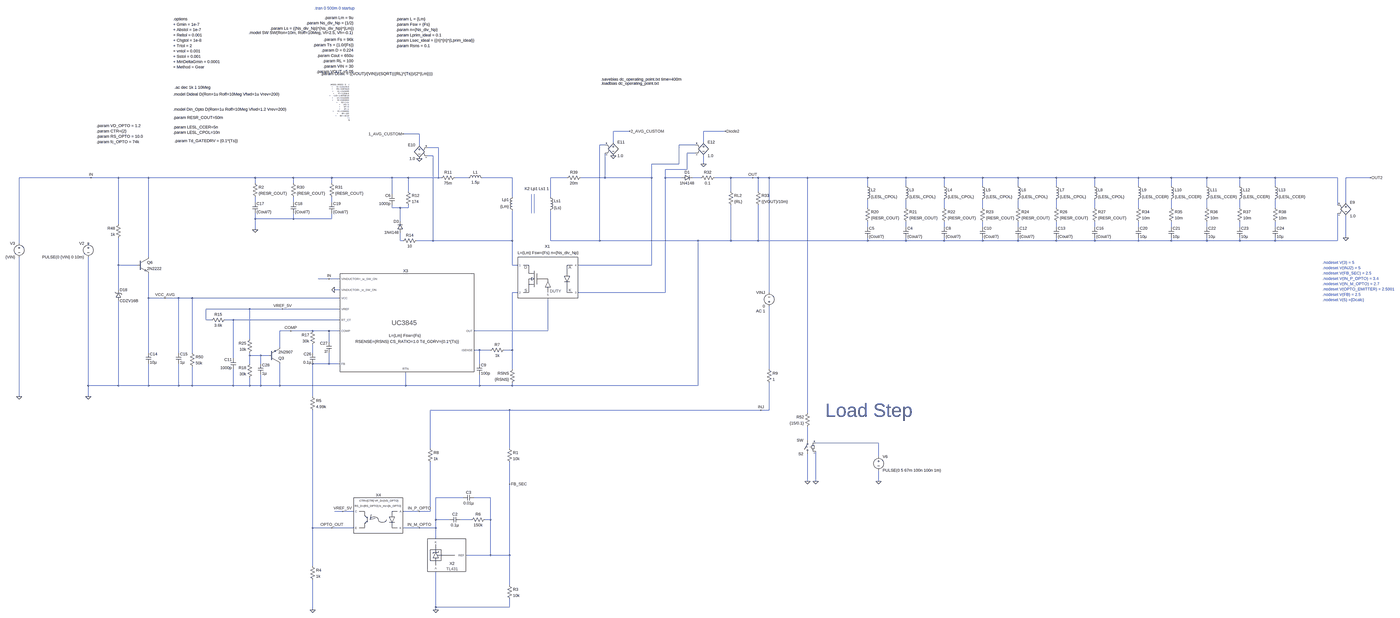
[diagram p0: schematic Demo_Flyback_AVGD_Model.asc, whole sheet]
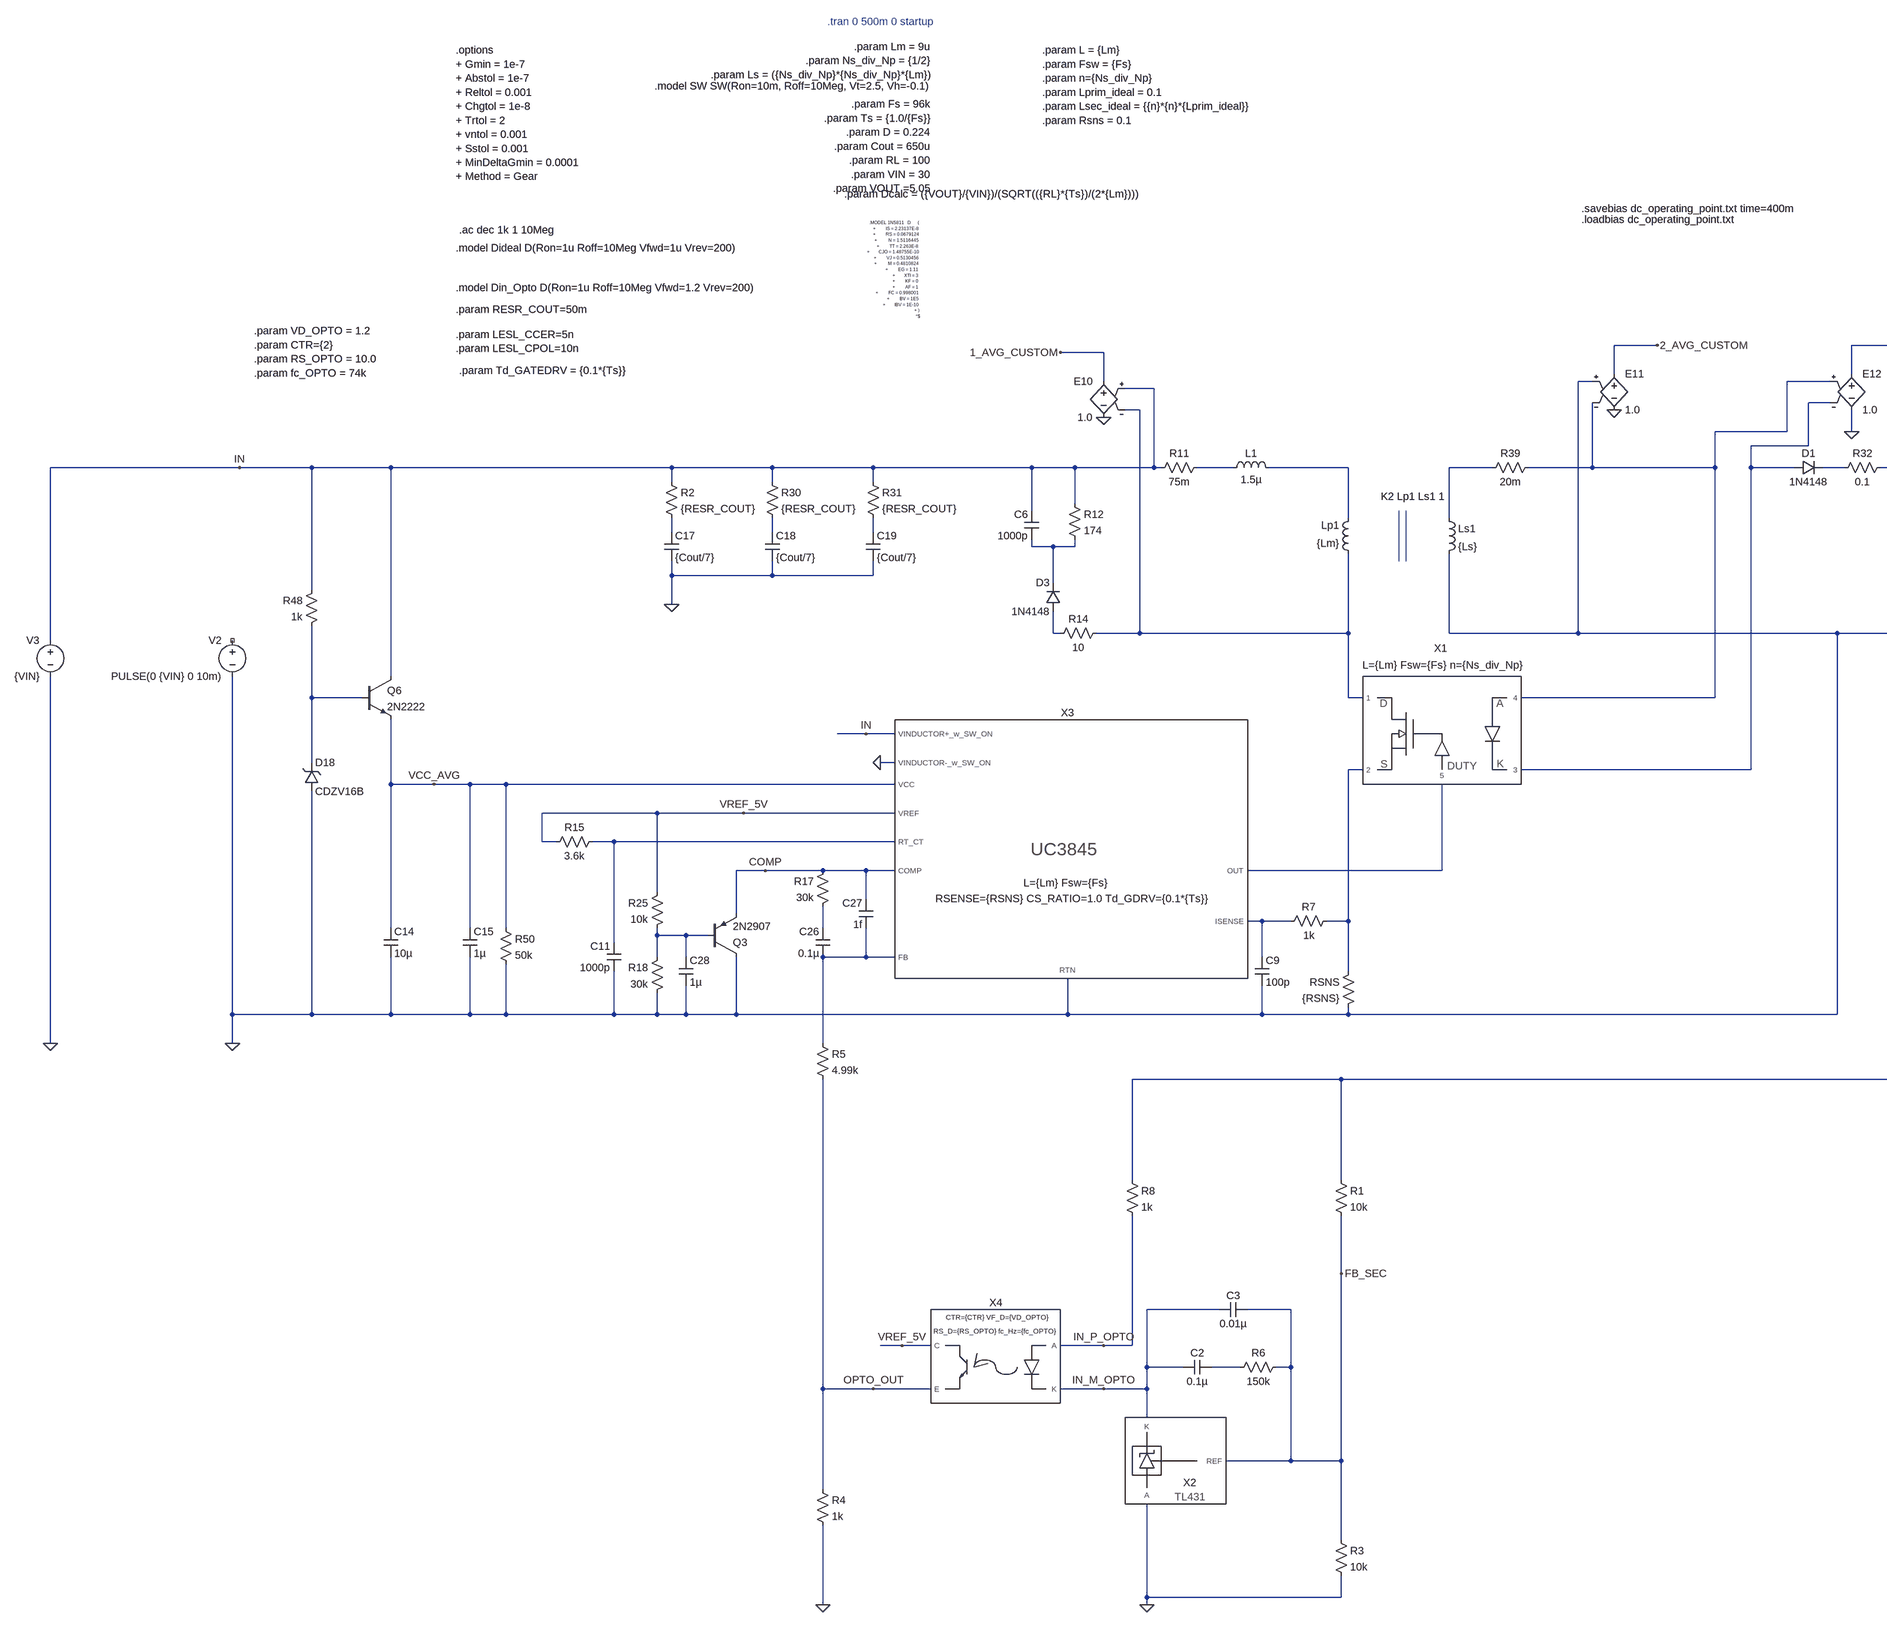
[diagram p1: schematic Demo_Flyback_AVGD_Model.asc, part, row 1 of 1, column 1 of 2]
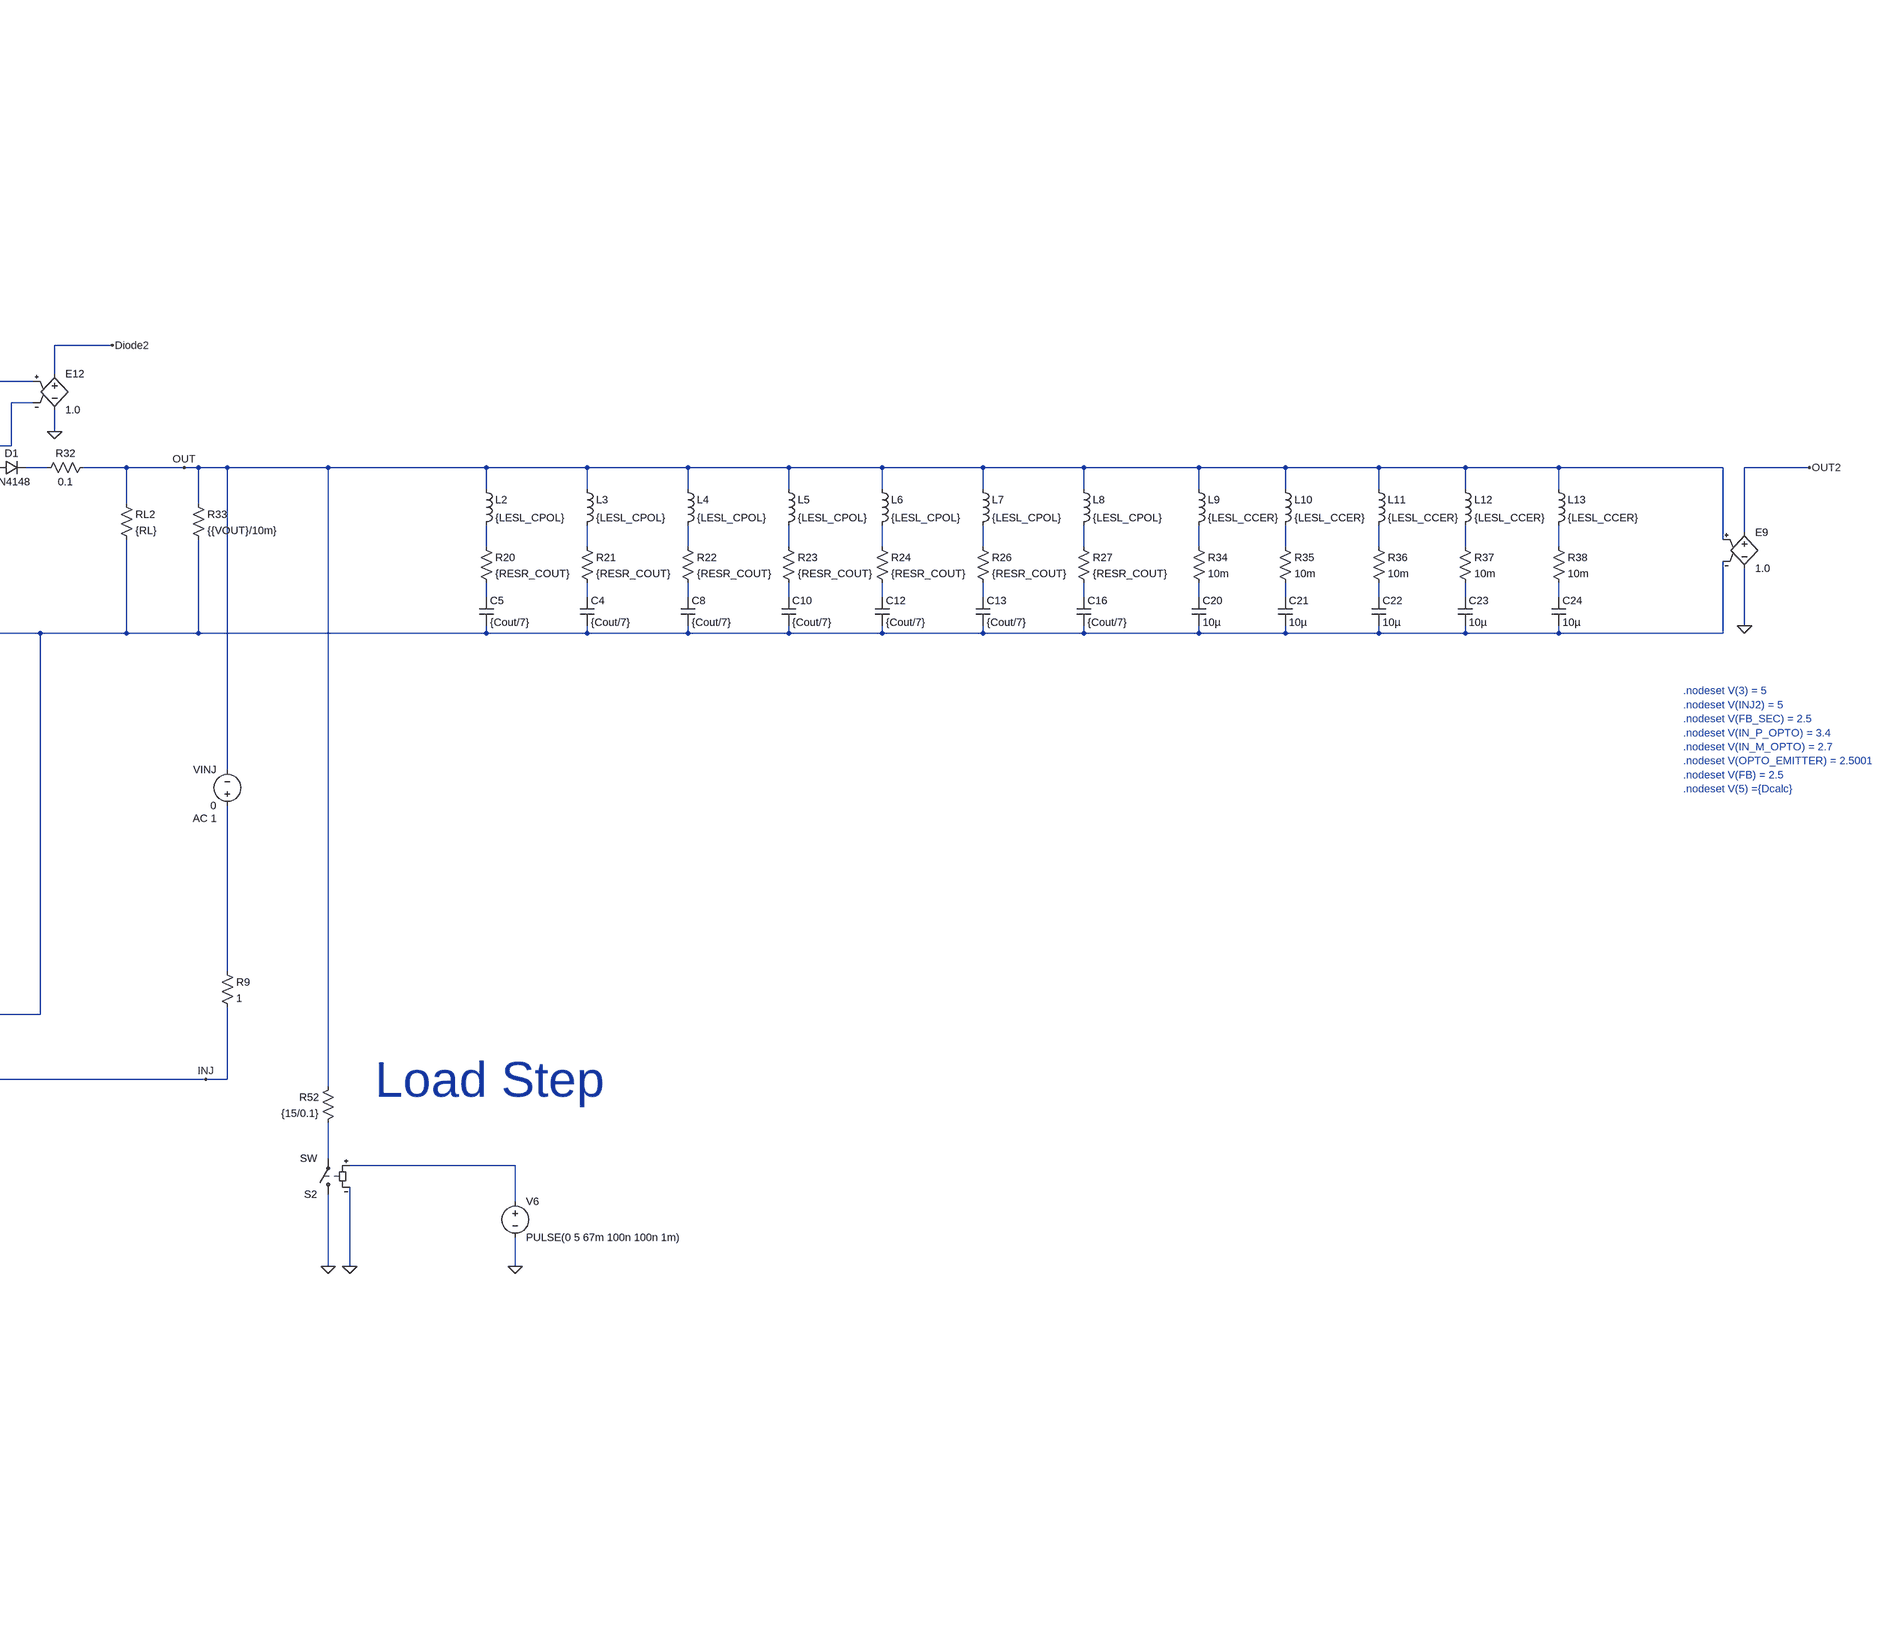
[diagram p2: schematic Demo_Flyback_AVGD_Model.asc, part, row 1 of 1, column 2 of 2]
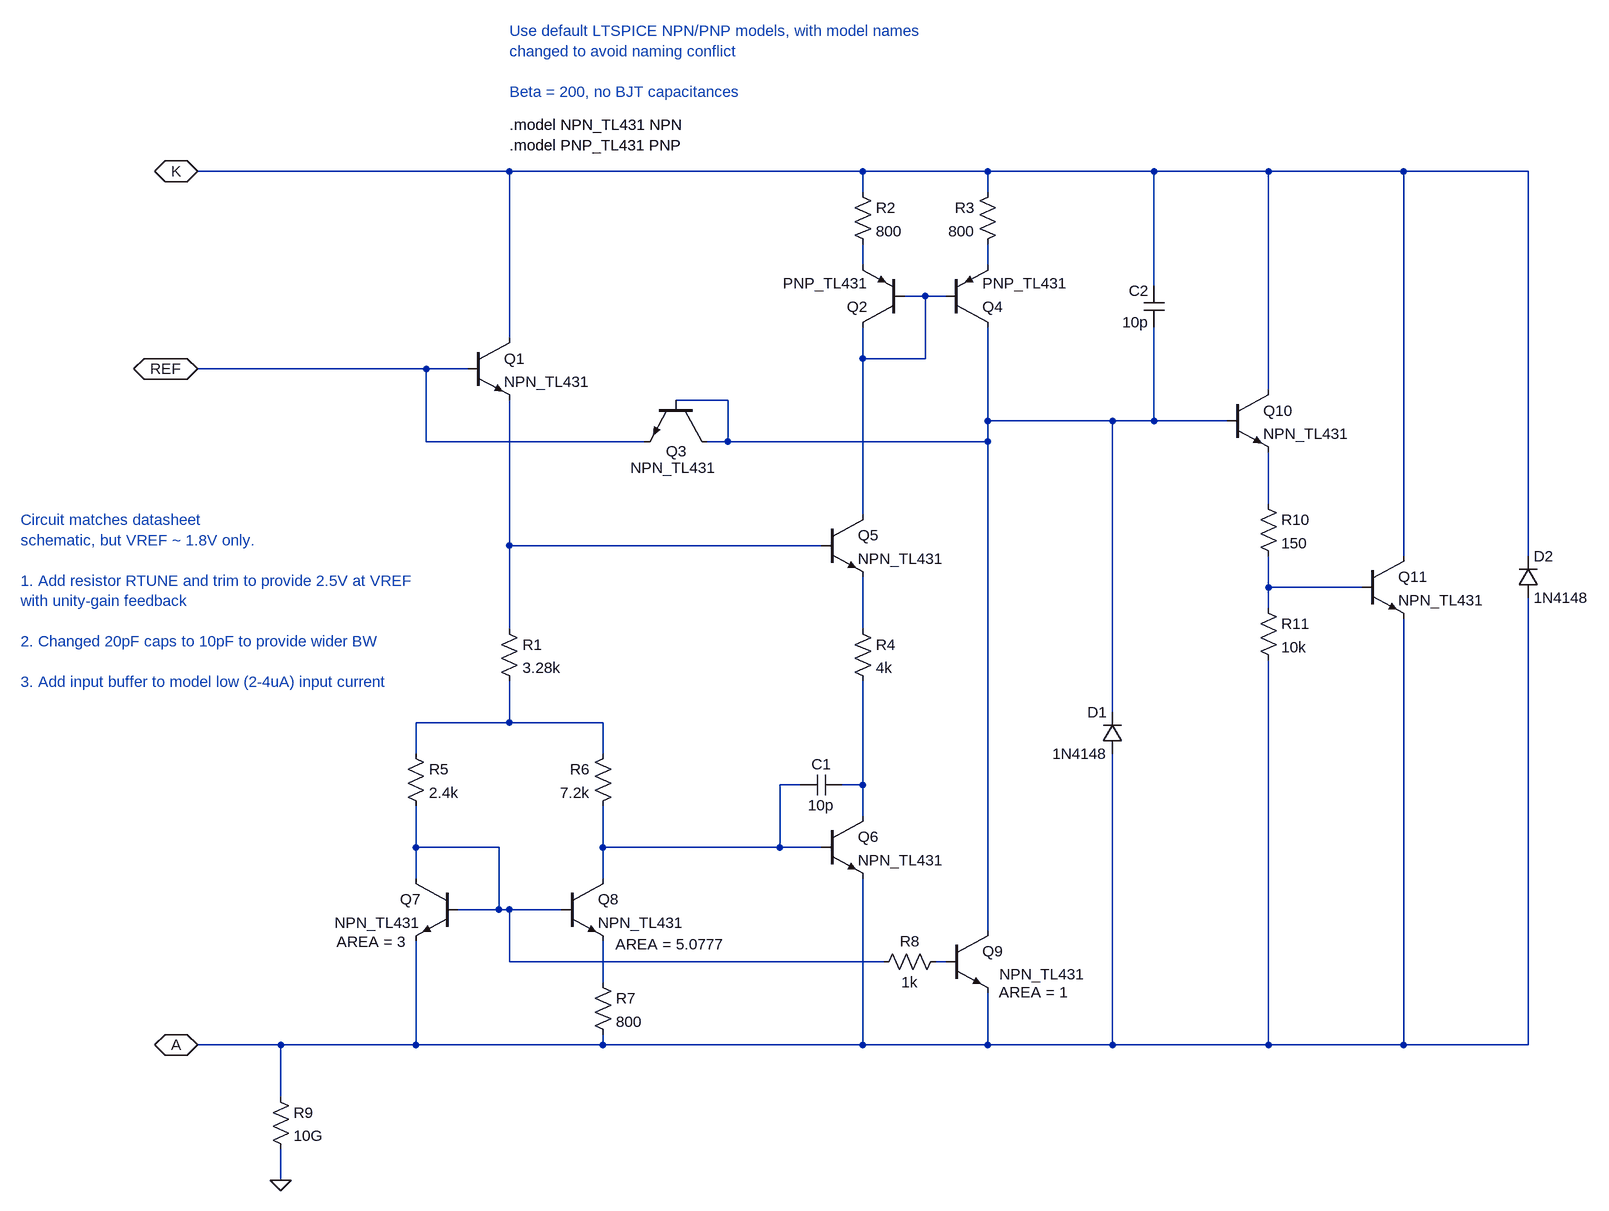
[diagram p3: sub-circuit tl431.asc]
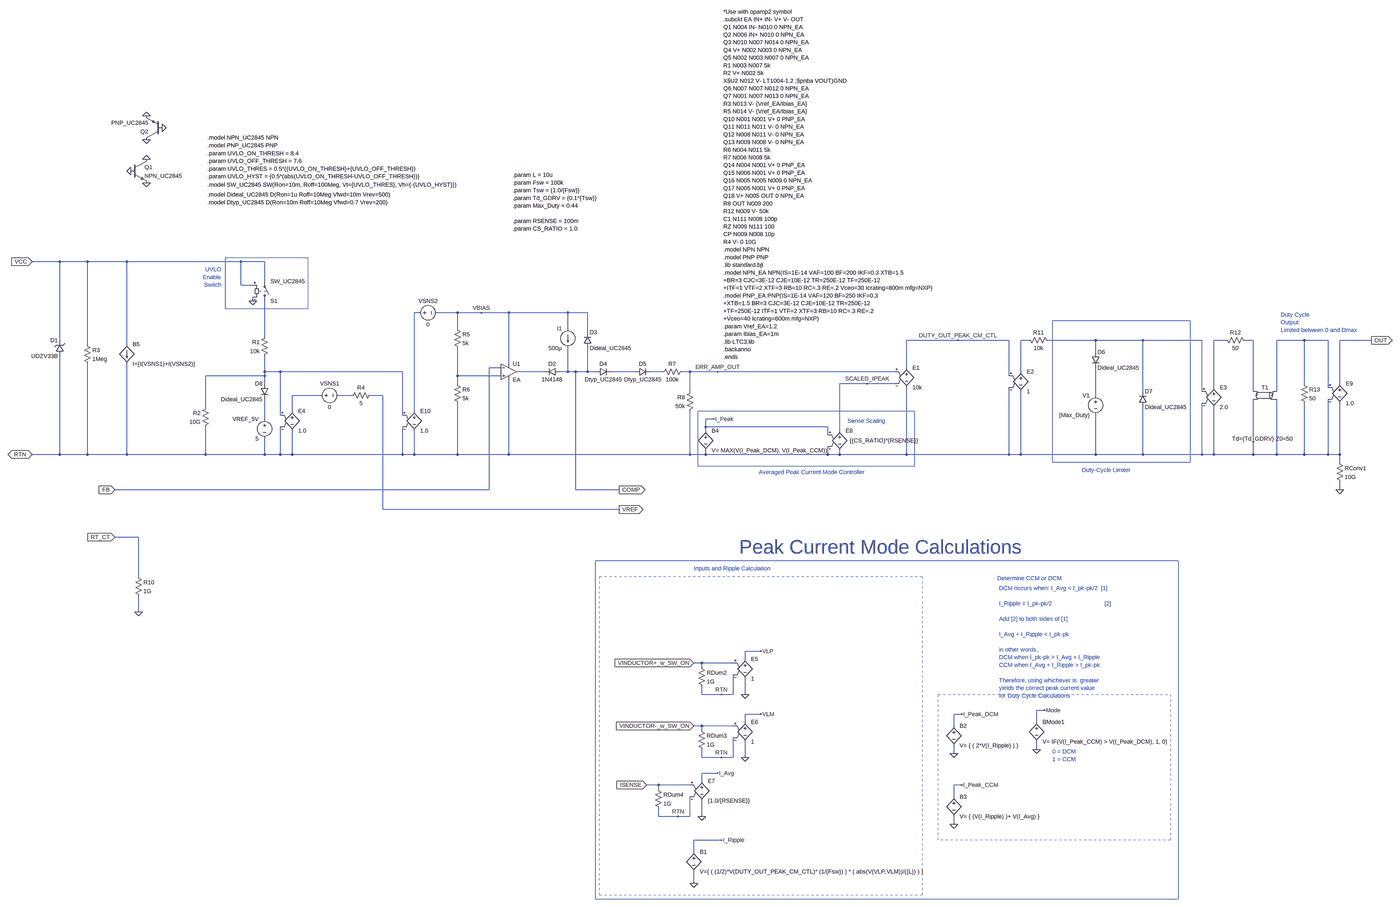
[diagram p4: sub-circuit uc3845_avg.asc, whole sheet]
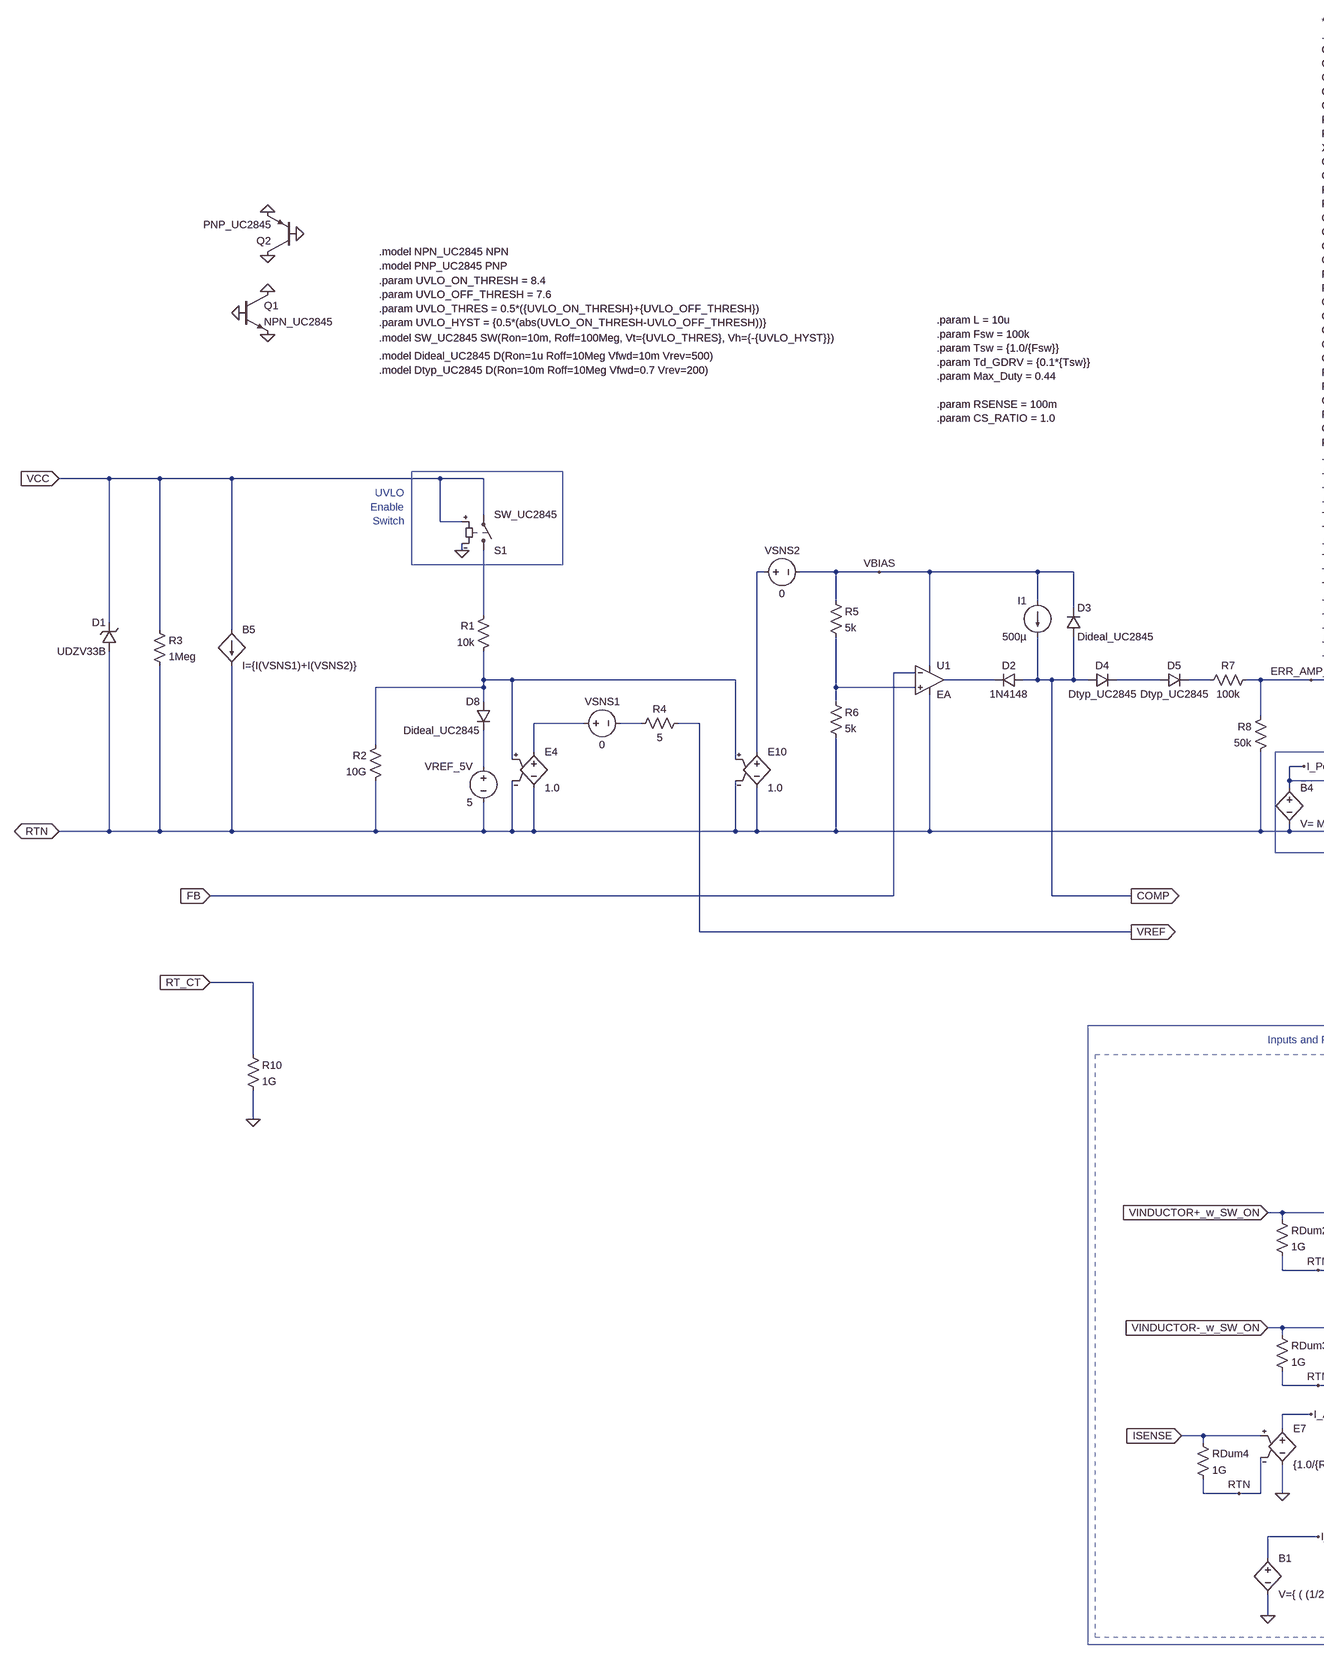
[diagram p5: sub-circuit uc3845_avg.asc, part, row 1 of 1, column 1 of 2]
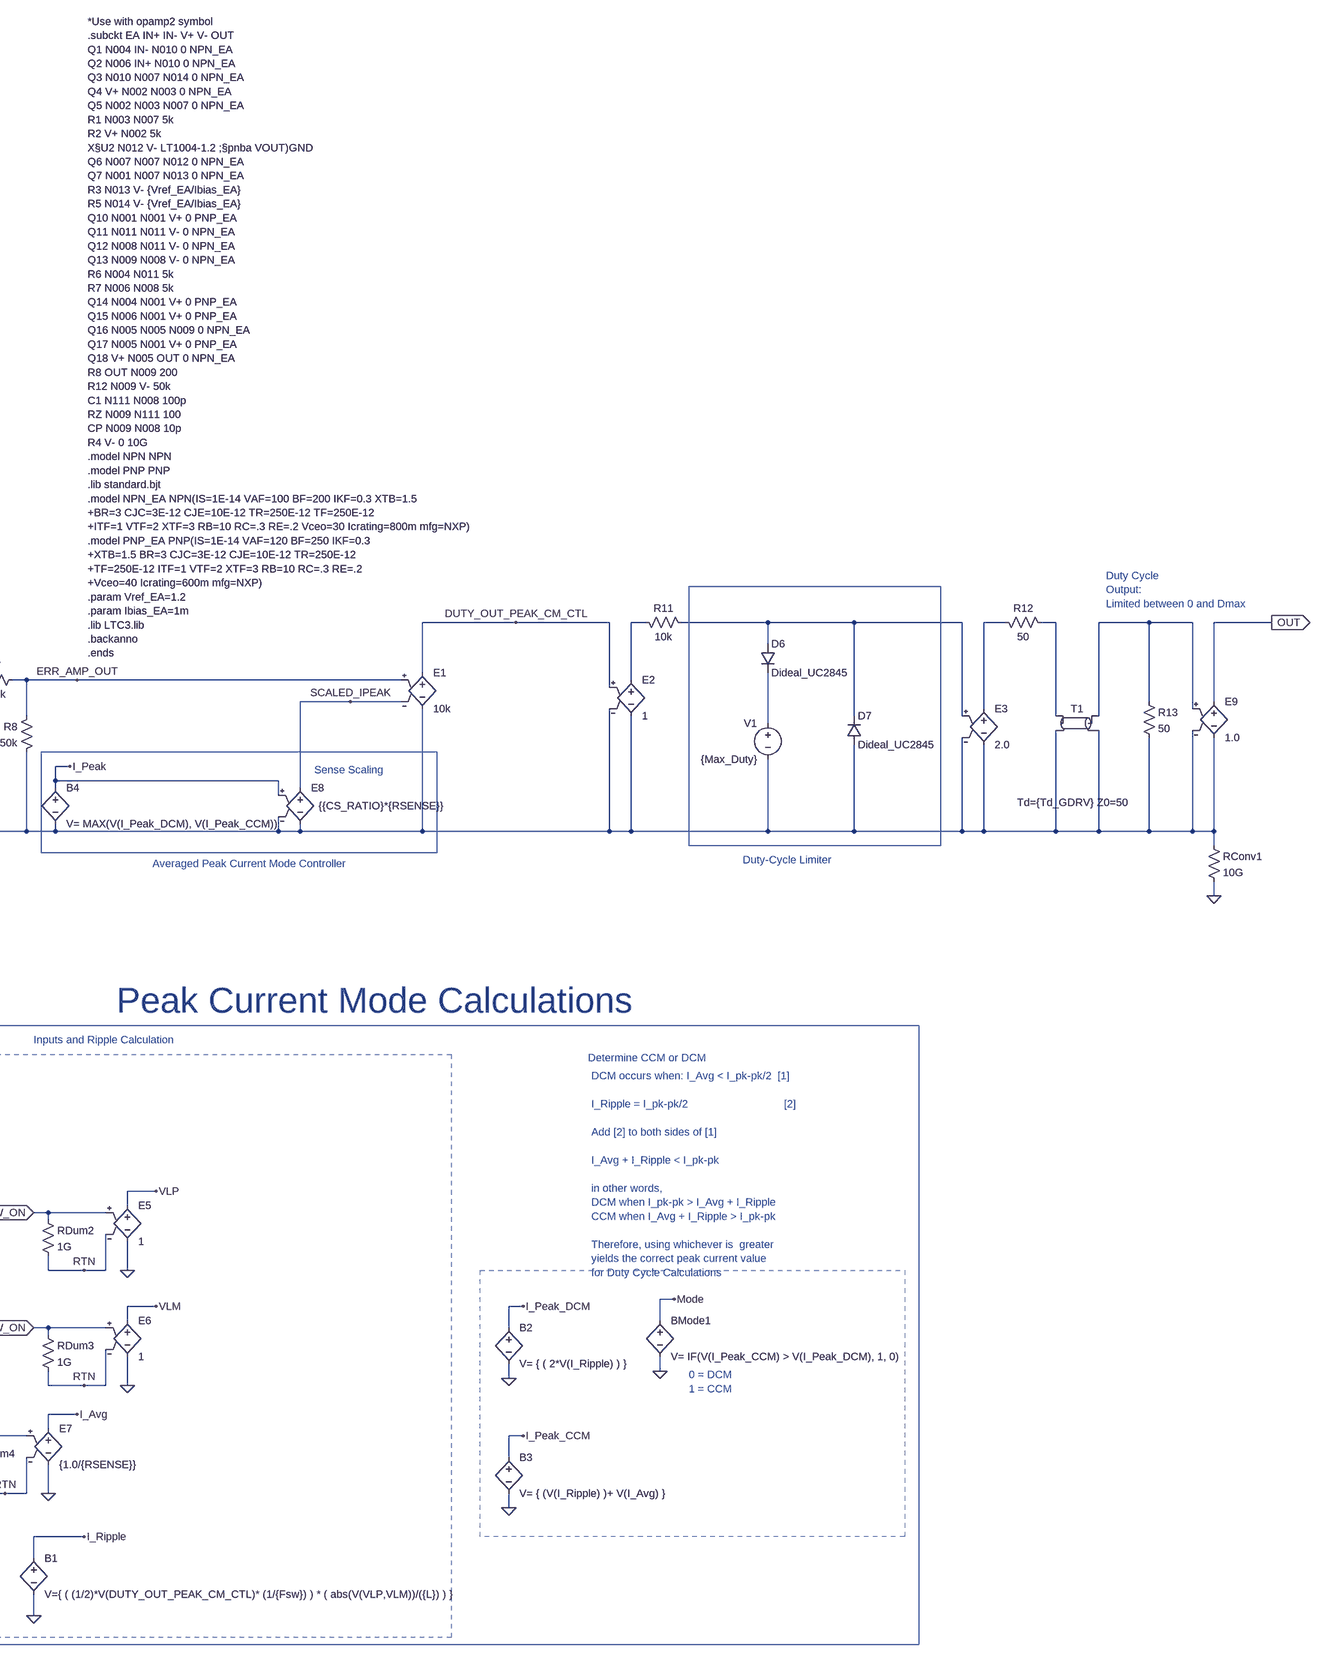
[diagram p6: sub-circuit uc3845_avg.asc, part, row 1 of 1, column 2 of 2]
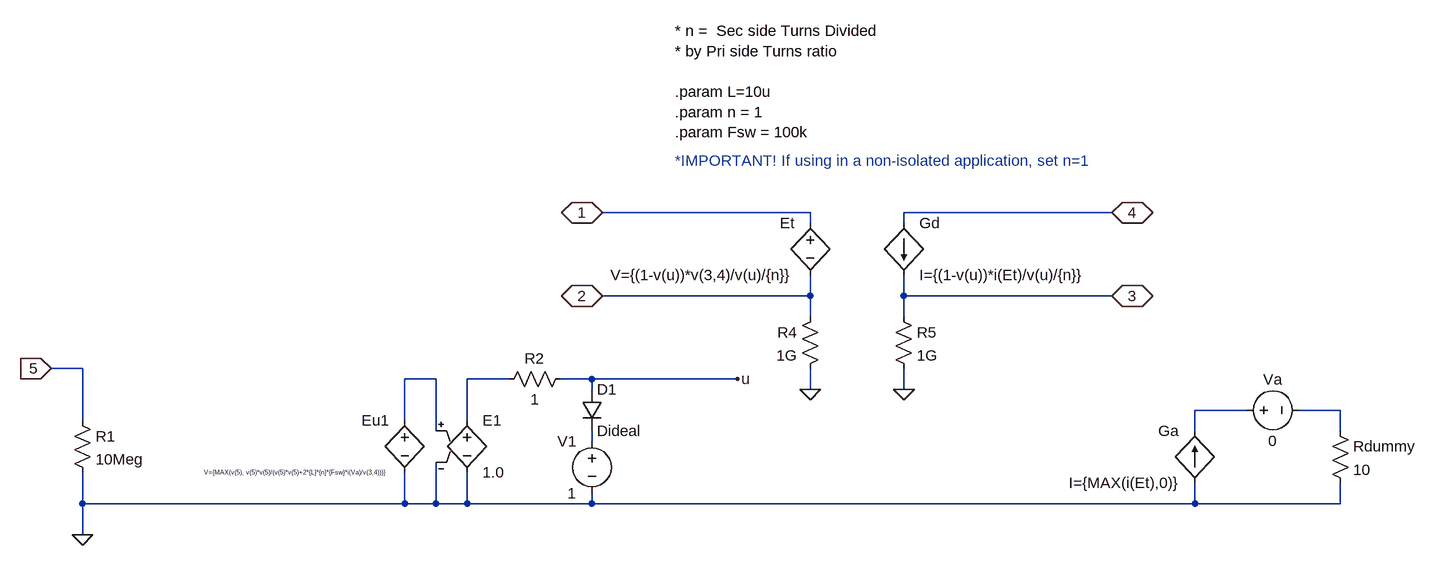
[diagram p7: sub-circuit ccm-dcm2.asc]
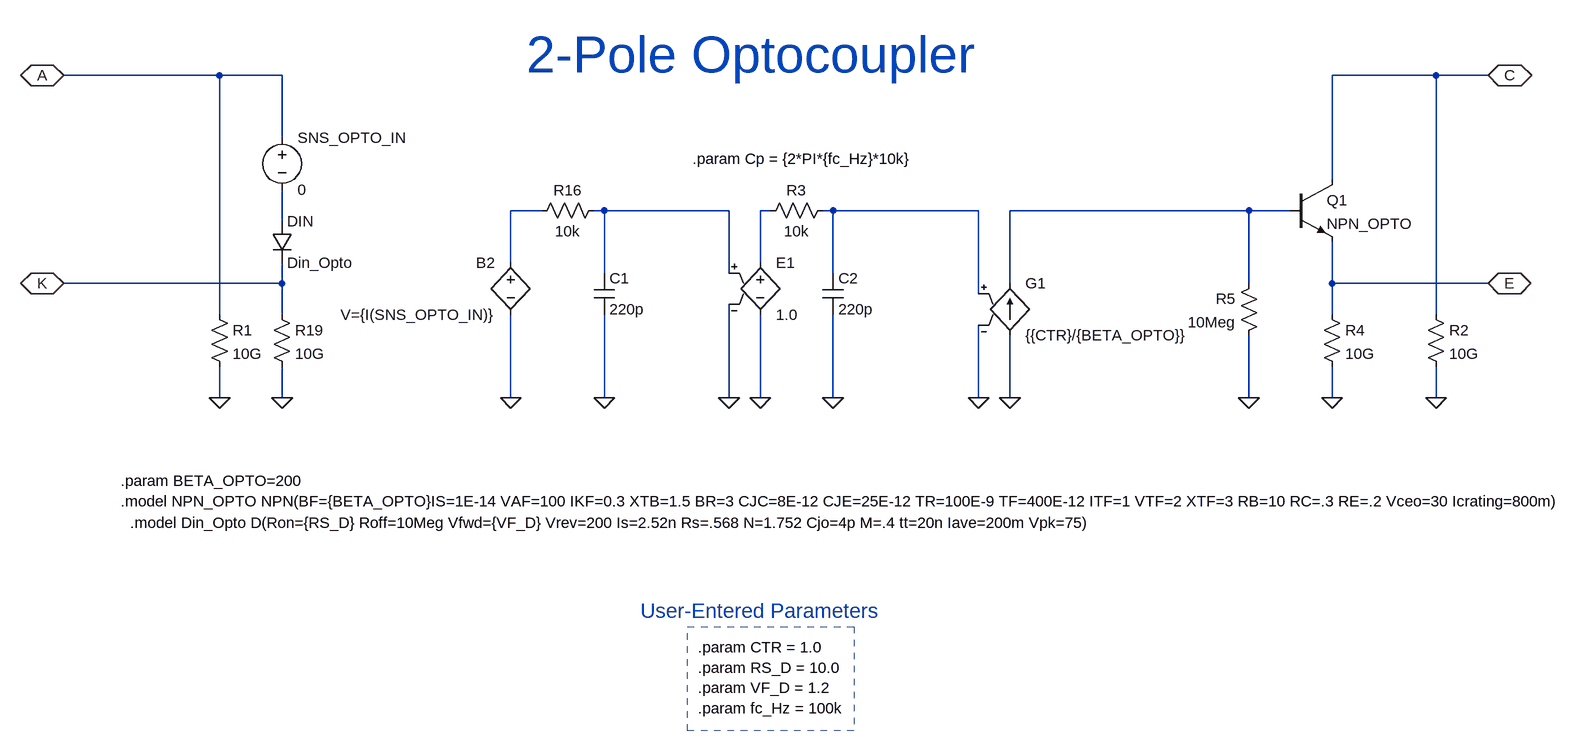
[diagram p8: sub-circuit opto_two_pole.asc]
Demo_Flyback_AVGD_Model.asc, the LTspice schematic file:
Version 4.1
SHEET 1 8320 5380
WIRE 3824 672 3728 672
WIRE 4384 672 4256 672
WIRE 2592 688 2496 688
WIRE 3728 736 3728 672
WIRE 4256 736 4256 672
WIRE 2592 752 2592 688
WIRE 3680 752 3648 752
WIRE 4208 752 4112 752
WIRE 2704 768 2640 768
WIRE 4208 800 4160 800
WIRE 2672 816 2640 816
WIRE 4112 864 4112 752
WIRE 4112 864 3952 864
WIRE 4256 864 4256 816
WIRE 4160 896 4160 800
WIRE 4160 896 4032 896
WIRE 672 944 240 944
WIRE 832 944 672 944
WIRE 1008 944 832 944
WIRE 1632 944 1008 944
WIRE 1856 944 1632 944
WIRE 2080 944 1856 944
WIRE 2432 944 2080 944
WIRE 2528 944 2432 944
WIRE 2704 944 2704 768
WIRE 2704 944 2528 944
WIRE 2720 944 2704 944
WIRE 2880 944 2800 944
WIRE 3136 944 2960 944
WIRE 3456 944 3360 944
WIRE 3680 944 3680 800
WIRE 3680 944 3536 944
WIRE 3952 944 3952 864
WIRE 3952 944 3680 944
WIRE 4032 944 4032 896
WIRE 4128 944 4032 944
WIRE 4240 944 4192 944
WIRE 4416 944 4320 944
WIRE 4544 944 4416 944
WIRE 4576 944 4544 944
WIRE 4640 944 4576 944
WIRE 4864 944 4640 944
WIRE 5216 944 4864 944
WIRE 5440 944 5216 944
WIRE 5664 944 5440 944
WIRE 5888 944 5664 944
WIRE 6096 944 5888 944
WIRE 6320 944 6096 944
WIRE 6544 944 6320 944
WIRE 6800 944 6544 944
WIRE 6992 944 6800 944
WIRE 7200 944 6992 944
WIRE 7392 944 7200 944
WIRE 7600 944 7392 944
WIRE 7968 944 7600 944
WIRE 8160 944 8016 944
WIRE 1632 976 1632 944
WIRE 1856 976 1856 944
WIRE 2080 976 2080 944
WIRE 5216 992 5216 944
WIRE 5440 992 5440 944
WIRE 5664 992 5664 944
WIRE 5888 992 5888 944
WIRE 6096 992 6096 944
WIRE 6320 992 6320 944
WIRE 6544 992 6544 944
WIRE 6800 992 6800 944
WIRE 6992 992 6992 944
WIRE 7200 992 7200 944
WIRE 7392 992 7392 944
WIRE 7600 992 7600 944
WIRE 2528 1024 2528 944
WIRE 4416 1024 4416 944
WIRE 4576 1024 4576 944
WIRE 2432 1040 2432 944
WIRE 3136 1056 3136 944
WIRE 3360 1056 3360 944
WIRE 1632 1088 1632 1056
WIRE 1856 1088 1856 1056
WIRE 2080 1088 2080 1056
WIRE 8016 1088 8016 944
WIRE 7968 1104 7968 944
WIRE 2432 1120 2432 1104
WIRE 2480 1120 2432 1120
WIRE 2528 1120 2528 1104
WIRE 2528 1120 2480 1120
WIRE 5216 1120 5216 1072
WIRE 5440 1120 5440 1072
WIRE 5664 1120 5664 1072
WIRE 5888 1120 5888 1072
WIRE 6096 1120 6096 1072
WIRE 6320 1120 6320 1072
WIRE 6544 1120 6544 1072
WIRE 6800 1120 6800 1072
WIRE 6992 1120 6992 1072
WIRE 7200 1120 7200 1072
WIRE 7392 1120 7392 1072
WIRE 7600 1120 7600 1072
WIRE 1632 1184 1632 1152
WIRE 1856 1184 1856 1152
WIRE 1856 1184 1632 1184
WIRE 2080 1184 2080 1152
WIRE 2080 1184 1856 1184
WIRE 2480 1200 2480 1120
WIRE 832 1216 832 944
WIRE 5216 1232 5216 1200
WIRE 5440 1232 5440 1200
WIRE 5664 1232 5664 1200
WIRE 5888 1232 5888 1200
WIRE 6096 1232 6096 1200
WIRE 6320 1232 6320 1200
WIRE 6544 1232 6544 1200
WIRE 6800 1232 6800 1200
WIRE 6992 1232 6992 1200
WIRE 7200 1232 7200 1200
WIRE 7392 1232 7392 1200
WIRE 7600 1232 7600 1200
WIRE 1632 1248 1632 1184
WIRE 8016 1296 8016 1168
WIRE 2480 1312 2480 1264
WIRE 2496 1312 2480 1312
WIRE 2672 1312 2672 816
WIRE 2672 1312 2576 1312
WIRE 3136 1312 3136 1136
WIRE 3136 1312 2672 1312
WIRE 3360 1312 3360 1136
WIRE 3648 1312 3648 752
WIRE 3648 1312 3360 1312
WIRE 4224 1312 3648 1312
WIRE 4416 1312 4416 1104
WIRE 4416 1312 4224 1312
WIRE 4576 1312 4576 1104
WIRE 4576 1312 4416 1312
WIRE 5216 1312 5216 1296
WIRE 5216 1312 4576 1312
WIRE 5440 1312 5440 1296
WIRE 5440 1312 5216 1312
WIRE 5664 1312 5664 1296
WIRE 5664 1312 5440 1312
WIRE 5888 1312 5888 1296
WIRE 5888 1312 5664 1312
WIRE 6096 1312 6096 1296
WIRE 6096 1312 5888 1312
WIRE 6320 1312 6320 1296
WIRE 6320 1312 6096 1312
WIRE 6544 1312 6544 1296
WIRE 6544 1312 6320 1312
WIRE 6800 1312 6800 1296
WIRE 6800 1312 6544 1312
WIRE 6992 1312 6992 1296
WIRE 6992 1312 6800 1312
WIRE 7200 1312 7200 1296
WIRE 7200 1312 6992 1312
WIRE 7392 1312 7392 1296
WIRE 7392 1312 7200 1312
WIRE 7600 1312 7600 1296
WIRE 7600 1312 7392 1312
WIRE 7968 1312 7968 1152
WIRE 7968 1312 7600 1312
WIRE 240 1328 240 944
WIRE 1008 1408 1008 944
WIRE 832 1456 832 1296
WIRE 944 1456 832 1456
WIRE 3136 1456 3136 1312
WIRE 3168 1456 3136 1456
WIRE 3952 1456 3952 944
WIRE 3952 1456 3520 1456
WIRE 2064 1536 2000 1536
WIRE 2128 1536 2064 1536
WIRE 832 1600 832 1456
WIRE 2128 1600 2096 1600
WIRE 3168 1616 3136 1616
WIRE 4032 1616 4032 944
WIRE 4032 1616 3520 1616
WIRE 4640 1616 4640 944
WIRE 1008 1648 1008 1504
WIRE 1104 1648 1008 1648
WIRE 1184 1648 1104 1648
WIRE 1264 1648 1184 1648
WIRE 2128 1648 1264 1648
WIRE 1600 1712 1344 1712
WIRE 1792 1712 1600 1712
WIRE 2128 1712 1792 1712
WIRE 1344 1776 1344 1712
WIRE 1376 1776 1344 1776
WIRE 1504 1776 1456 1776
WIRE 2128 1776 1504 1776
WIRE 1840 1840 1776 1840
WIRE 1968 1840 1840 1840
WIRE 2064 1840 1968 1840
WIRE 2128 1840 2064 1840
WIRE 3344 1840 3344 1648
WIRE 3344 1840 2912 1840
WIRE 1600 1888 1600 1712
WIRE 2064 1904 2064 1840
WIRE 1776 1936 1776 1840
WIRE 2944 1952 2912 1952
WIRE 3008 1952 2944 1952
WIRE 3136 1952 3136 1616
WIRE 3136 1952 3088 1952
WIRE 1008 1968 1008 1648
WIRE 1184 1968 1184 1648
WIRE 1264 1968 1264 1648
WIRE 1968 1968 1968 1920
WIRE 1600 1984 1600 1968
WIRE 1664 1984 1600 1984
WIRE 1712 1984 1664 1984
WIRE 1504 2000 1504 1776
WIRE 1600 2032 1600 1984
WIRE 1664 2032 1664 1984
WIRE 1968 2032 1968 2016
WIRE 2064 2032 2064 1968
WIRE 2064 2032 1968 2032
WIRE 2128 2032 2064 2032
WIRE 2944 2032 2944 1952
WIRE 3136 2064 3136 1952
WIRE 4640 2064 4640 1696
WIRE 656 2160 656 1408
WIRE 832 2160 832 1664
WIRE 832 2160 656 2160
WIRE 1008 2160 1008 2032
WIRE 1008 2160 832 2160
WIRE 1184 2160 1184 2032
WIRE 1184 2160 1008 2160
WIRE 1264 2160 1264 2048
WIRE 1264 2160 1184 2160
WIRE 1504 2160 1504 2064
WIRE 1504 2160 1264 2160
WIRE 1600 2160 1600 2112
WIRE 1600 2160 1504 2160
WIRE 1664 2160 1664 2096
WIRE 1664 2160 1600 2160
WIRE 1776 2160 1776 2032
WIRE 1776 2160 1664 2160
WIRE 2512 2160 2512 2080
WIRE 2512 2160 1776 2160
WIRE 2944 2160 2944 2096
WIRE 2944 2160 2512 2160
WIRE 3136 2160 3136 2144
WIRE 3136 2160 2944 2160
WIRE 4224 2160 4224 1312
WIRE 4224 2160 3136 2160
WIRE 240 2224 240 1408
WIRE 656 2224 656 2160
WIRE 1968 2224 1968 2032
WIRE 3120 2304 2656 2304
WIRE 4592 2304 3120 2304
WIRE 4640 2304 4640 2144
WIRE 4640 2304 4592 2304
WIRE 4864 2320 4864 944
WIRE 4864 2480 4864 2400
WIRE 5280 2496 4912 2496
WIRE 2656 2528 2656 2304
WIRE 3120 2528 3120 2304
WIRE 5280 2576 5280 2496
WIRE 4864 2720 4864 2560
WIRE 4912 2720 4912 2544
WIRE 5280 2720 5280 2656
WIRE 3120 2736 3120 2608
WIRE 2848 2816 2688 2816
WIRE 3008 2816 2912 2816
WIRE 2144 2896 2096 2896
WIRE 2208 2896 2144 2896
WIRE 2592 2896 2496 2896
WIRE 2656 2896 2656 2608
WIRE 2656 2896 2592 2896
WIRE 2688 2944 2688 2816
WIRE 2768 2944 2688 2944
WIRE 2896 2944 2832 2944
WIRE 3008 2944 3008 2816
WIRE 3008 2944 2976 2944
WIRE 1968 2992 1968 2304
WIRE 2080 2992 1968 2992
WIRE 2208 2992 2080 2992
WIRE 2592 2992 2496 2992
WIRE 2688 2992 2688 2944
WIRE 2688 2992 2592 2992
WIRE 2688 3056 2688 2992
WIRE 3008 3152 3008 2944
WIRE 3008 3152 2864 3152
WIRE 3120 3152 3120 2736
WIRE 3120 3152 3008 3152
WIRE 1968 3216 1968 2992
WIRE 3120 3328 3120 3152
WIRE 2688 3456 2688 3248
WIRE 3120 3456 3120 3408
WIRE 3120 3456 2688 3456
WIRE 1968 3472 1968 3296
WIRE 2688 3472 2688 3456
FLAG 8016 1296 0
FLAG 8160 944 OUT2
FLAG 2592 832 0
FLAG 3728 816 0
FLAG 2496 688 1_AVG_CUSTOM
FLAG 3824 672 2_AVG_CUSTOM
FLAG 4256 864 0
FLAG 4384 672 Diode2
FLAG 1104 1648 VCC_AVG
FLAG 4864 2720 0
FLAG 4912 2720 0
FLAG 5280 2720 0
FLAG 656 2224 0
FLAG 672 944 IN
FLAG 4592 2304 INJ
FLAG 2688 3472 0
FLAG 3120 2736 FB_SEC
FLAG 2592 2992 IN_M_OPTO
FLAG 4544 944 OUT
FLAG 240 2224 0
FLAG 1632 1248 0
FLAG 2064 1536 IN
FLAG 2096 1600 0
FLAG 1792 1712 VREF_5V
FLAG 2592 2896 IN_P_OPTO
FLAG 1968 3472 0
FLAG 2144 2896 VREF_5V
FLAG 1840 1840 COMP
FLAG 2080 2992 OPTO_OUT
DATAFLAG 4672 944 ""
DATAFLAG 2352 944 ""
DATAFLAG 3056 3152 ""
DATAFLAG 1264 1648 ""
DATAFLAG 4224 2080 ""
DATAFLAG 2656 2736 ""
DATAFLAG 2736 2816 ""
DATAFLAG 1968 2912 ""
DATAFLAG 1984 1712 ""
DATAFLAG 1984 1648 ""
DATAFLAG 2992 1840 ""
DATAFLAG 2032 1840 ""
SYMBOL res 4400 1008 R0
SYMATTR InstName RL2
SYMATTR Value {RL}
SYMBOL cap 5200 1232 R0
SYMATTR InstName C5
SYMATTR Value {Cout/7}
SYMBOL e 8016 1072 R0
SYMATTR InstName E9
SYMATTR Value 1.0
SYMBOL res 2704 960 R270
WINDOW 0 32 56 VTop 2
WINDOW 3 0 56 VBottom 2
SYMATTR InstName R11
SYMATTR Value 75m
SYMBOL e 2592 736 M0
SYMATTR InstName E10
SYMATTR Value 1.0
SYMBOL e 3728 720 R0
SYMATTR InstName E11
SYMATTR Value 1.0
SYMBOL diode 2496 1264 R180
WINDOW 0 24 64 Left 2
WINDOW 3 24 0 Left 2
SYMATTR InstName D3
SYMATTR Value 1N4148
SYMBOL cap 2448 1040 M0
SYMATTR InstName C6
SYMATTR Value 1000p
SYMBOL res 2512 1008 R0
SYMATTR InstName R12
SYMATTR Value 174
SYMBOL e 4256 720 R0
SYMATTR InstName E12
SYMATTR Value 1.0
SYMBOL res 2592 1296 R90
WINDOW 0 0 56 VBottom 2
WINDOW 3 32 56 VTop 2
SYMATTR InstName R14
SYMATTR Value 10
SYMBOL res 3152 2048 M0
SYMATTR InstName RSNS
SYMATTR Value {RSNS}
SYMBOL zener 816 1664 M180
WINDOW 0 24 64 Left 2
WINDOW 3 24 0 Left 2
SYMATTR InstName D18
SYMATTR Value CDZV16B
SYMBOL res 848 1200 M0
SYMATTR InstName R48
SYMATTR Value 1k
SYMBOL npn 944 1408 R0
SYMATTR InstName Q6
SYMATTR Value 2N2222
SYMBOL cap 992 1968 R0
SYMATTR InstName C14
SYMATTR Value 10µ
SYMBOL cap 1168 1968 R0
SYMATTR InstName C15
SYMATTR Value 1µ
SYMBOL res 1248 1952 R0
SYMATTR InstName R50
SYMATTR Value 50k
SYMBOL sw 4864 2576 R180
SYMATTR InstName S2
SYMBOL res 4880 2304 M0
SYMATTR InstName R52
SYMATTR Value {15/0.1}
SYMBOL voltage 5280 2560 R0
WINDOW 123 0 0 Left 0
WINDOW 39 0 0 Left 0
SYMATTR InstName V6
SYMATTR Value PULSE(0 5 67m 100n 100n 1m)
SYMBOL ind 3152 1152 R180
WINDOW 0 36 80 Left 2
WINDOW 3 36 40 Left 2
SYMATTR InstName Lp1
SYMATTR Value {Lm}
SYMATTR Type ind
SYMBOL ind 3344 1040 R0
SYMATTR InstName Ls1
SYMATTR Value {Ls}
SYMATTR Type ind
SYMBOL voltage 656 1312 M0
WINDOW 123 0 0 Left 0
WINDOW 39 0 0 Left 0
SYMATTR InstName V2
SYMATTR Value PULSE(0 {VIN} 0 10m)
SYMBOL res 3104 2512 R0
SYMATTR InstName R1
SYMATTR Value 10k
SYMBOL res 3104 3312 R0
SYMATTR InstName R3
SYMATTR Value 10k
SYMBOL cap 2832 2928 R90
WINDOW 0 0 32 VBottom 2
WINDOW 3 32 32 VTop 2
SYMATTR InstName C2
SYMATTR Value 0.1µ
SYMBOL res 2992 2928 R90
WINDOW 0 0 56 VBottom 2
WINDOW 3 32 56 VTop 2
SYMATTR InstName R6
SYMATTR Value 150k
SYMBOL res 2640 2512 R0
SYMATTR InstName R8
SYMATTR Value 1k
SYMBOL res 4624 2048 R0
SYMATTR InstName R9
SYMATTR Value 1
SYMBOL cap 2912 2800 R90
WINDOW 0 0 32 VBottom 2
WINDOW 3 32 32 VTop 2
SYMATTR InstName C3
SYMATTR Value 0.01µ
SYMBOL voltage 4640 1712 R180
WINDOW 0 24 96 Left 2
WINDOW 3 24 16 Left 2
WINDOW 123 24 -12 Left 2
WINDOW 39 0 0 Left 0
SYMATTR InstName VINJ
SYMATTR Value 0
SYMATTR Value2 AC 1
SYMBOL TL431 2752 3152 M0
SYMATTR InstName X2
SYMBOL voltage 240 1312 M0
WINDOW 123 0 0 Left 0
WINDOW 39 0 0 Left 0
SYMATTR InstName V3
SYMATTR Value {VIN}
SYMBOL res 5200 1104 R0
SYMATTR InstName R20
SYMATTR Value {RESR_COUT}
SYMBOL diode 4128 960 R270
WINDOW 0 32 32 VTop 2
WINDOW 3 0 32 VBottom 2
SYMATTR InstName D1
SYMATTR Value 1N4148
SYMBOL cap 5424 1232 R0
SYMATTR InstName C4
SYMATTR Value {Cout/7}
SYMBOL res 5424 1104 R0
SYMATTR InstName R21
SYMATTR Value {RESR_COUT}
SYMBOL cap 5648 1232 R0
SYMATTR InstName C8
SYMATTR Value {Cout/7}
SYMBOL res 5648 1104 R0
SYMATTR InstName R22
SYMATTR Value {RESR_COUT}
SYMBOL cap 5872 1232 R0
SYMATTR InstName C10
SYMATTR Value {Cout/7}
SYMBOL res 5872 1104 R0
SYMATTR InstName R23
SYMATTR Value {RESR_COUT}
SYMBOL cap 6080 1232 R0
SYMATTR InstName C12
SYMATTR Value {Cout/7}
SYMBOL res 6080 1104 R0
SYMATTR InstName R24
SYMATTR Value {RESR_COUT}
SYMBOL cap 6304 1232 R0
SYMATTR InstName C13
SYMATTR Value {Cout/7}
SYMBOL res 6304 1104 R0
SYMATTR InstName R26
SYMATTR Value {RESR_COUT}
SYMBOL cap 6528 1232 R0
SYMATTR InstName C16
SYMATTR Value {Cout/7}
SYMBOL res 6528 1104 R0
SYMATTR InstName R27
SYMATTR Value {RESR_COUT}
SYMBOL ind 2864 960 R270
WINDOW 0 32 56 VTop 2
WINDOW 3 5 56 VBottom 2
SYMATTR InstName L1
SYMATTR Value 1.5µ
SYMBOL cap 1616 1088 R0
SYMATTR InstName C17
SYMATTR Value {Cout/7}
SYMBOL res 1616 960 R0
SYMATTR InstName R2
SYMATTR Value {RESR_COUT}
SYMBOL cap 1840 1088 R0
SYMATTR InstName C18
SYMATTR Value {Cout/7}
SYMBOL res 1840 960 R0
SYMATTR InstName R30
SYMATTR Value {RESR_COUT}
SYMBOL cap 2064 1088 R0
SYMATTR InstName C19
SYMATTR Value {Cout/7}
SYMBOL res 2064 960 R0
SYMATTR InstName R31
SYMATTR Value {RESR_COUT}
SYMBOL res 4336 928 R90
WINDOW 0 0 56 VBottom 2
WINDOW 3 32 56 VTop 2
SYMATTR InstName R32
SYMATTR Value 0.1
SYMBOL res 4560 1008 R0
SYMATTR InstName R33
SYMATTR Value {{VOUT}/10m}
SYMBOL ind 5200 976 R0
SYMATTR InstName L2
SYMATTR Value {LESL_CPOL}
SYMBOL ind 5424 976 R0
SYMATTR InstName L3
SYMATTR Value {LESL_CPOL}
SYMBOL ind 5648 976 R0
SYMATTR InstName L4
SYMATTR Value {LESL_CPOL}
SYMBOL ind 5872 976 R0
SYMATTR InstName L5
SYMATTR Value {LESL_CPOL}
SYMBOL ind 6080 976 R0
SYMATTR InstName L6
SYMATTR Value {LESL_CPOL}
SYMBOL ind 6304 976 R0
SYMATTR InstName L7
SYMATTR Value {LESL_CPOL}
SYMBOL ind 6528 976 R0
SYMATTR InstName L8
SYMATTR Value {LESL_CPOL}
SYMBOL cap 6784 1232 R0
SYMATTR InstName C20
SYMATTR Value 10µ
SYMBOL res 6784 1104 R0
SYMATTR InstName R34
SYMATTR Value 10m
SYMBOL ind 6784 976 R0
SYMATTR InstName L9
SYMATTR Value {LESL_CCER}
SYMBOL cap 6976 1232 R0
SYMATTR InstName C21
SYMATTR Value 10µ
SYMBOL res 6976 1104 R0
SYMATTR InstName R35
SYMATTR Value 10m
SYMBOL ind 6976 976 R0
SYMATTR InstName L10
SYMATTR Value {LESL_CCER}
SYMBOL cap 7184 1232 R0
SYMATTR InstName C22
SYMATTR Value 10µ
SYMBOL res 7184 1104 R0
SYMATTR InstName R36
SYMATTR Value 10m
SYMBOL ind 7184 976 R0
SYMATTR InstName L11
SYMATTR Value {LESL_CCER}
SYMBOL cap 7376 1232 R0
SYMATTR InstName C23
SYMATTR Value 10µ
SYMBOL res 7376 1104 R0
SYMATTR InstName R37
SYMATTR Value 10m
SYMBOL ind 7376 976 R0
SYMATTR InstName L12
SYMATTR Value {LESL_CCER}
SYMBOL cap 7584 1232 R0
SYMATTR InstName C24
SYMATTR Value 10µ
SYMBOL res 7584 1104 R0
SYMATTR InstName R38
SYMATTR Value 10m
SYMBOL ind 7584 976 R0
SYMATTR InstName L13
SYMATTR Value {LESL_CCER}
SYMBOL res 3552 928 R90
WINDOW 0 0 56 VBottom 2
WINDOW 3 32 56 VTop 2
SYMATTR InstName R39
SYMATTR Value 20m
SYMBOL cap 2928 2032 R0
SYMATTR InstName C9
SYMATTR Value 100p
SYMBOL res 2992 1968 R270
WINDOW 0 32 56 VTop 2
WINDOW 3 0 56 VBottom 2
SYMATTR InstName R7
SYMATTR Value 1k
SYMBOL cap 1520 2000 M0
SYMATTR InstName C11
SYMATTR Value 1000p
SYMBOL res 1360 1792 R270
WINDOW 0 32 56 VTop 2
WINDOW 3 0 56 VBottom 2
SYMATTR InstName R15
SYMATTR Value 3.6k
SYMBOL cap 1984 1968 M0
SYMATTR InstName C26
SYMATTR Value 0.1µ
SYMBOL res 1984 1824 M0
SYMATTR InstName R17
SYMATTR Value 30k
SYMBOL cap 2080 1904 M0
SYMATTR InstName C27
SYMATTR Value 1f
SYMBOL pnp 1712 2032 M180
SYMATTR InstName Q3
SYMATTR Value 2N2907
SYMBOL cap 1648 2032 R0
SYMATTR InstName C28
SYMATTR Value 1µ
SYMBOL res 1616 2016 M0
SYMATTR InstName R18
SYMATTR Value 30k
SYMBOL res 1616 1872 M0
SYMATTR InstName R25
SYMATTR Value 10k
SYMBOL UC3845_AVG 2512 1872 R0
SYMATTR InstName X3
SYMATTR SpiceLine L={Lm} Fsw={Fs}
SYMATTR SpiceLine2 RSENSE={RSNS} CS_RATIO=1.0 Td_GDRV={0.1*{Ts}}
SYMBOL ccm-dcm2 3344 1536 R0
SYMATTR InstName X1
SYMATTR SpiceLine L={Lm} Fsw={Fs} n={Ns_div_Np}
SYMBOL Opto_Two_Pole 2352 2928 M0
WINDOW 39 -4 -95 Center 1
WINDOW 40 2 -64 Center 1
SYMATTR SpiceLine CTR={CTR} VF_D={VD_OPTO}
SYMATTR SpiceLine2 RS_D={RS_OPTO} fc_Hz={fc_OPTO}
SYMATTR InstName X4
SYMBOL res 1952 3200 R0
SYMATTR InstName R4
SYMATTR Value 1k
SYMBOL res 1952 2208 R0
SYMATTR InstName R5
SYMATTR Value 4.99k
TEXT 4968 2304 Left 7 ;Load Step
TEXT 3208 1008 Left 2 !K2 Lp1 Ls1 1
TEXT 7880 1440 Left 2 ;.nodeset V(3) = 5\n.nodeset V(INJ2) = 5\n.nodeset V(FB_SEC) = 2.5\n.nodeset V(IN_P_OPTO) = 3.4\n.nodeset V(IN_M_OPTO) = 2.7\n.nodeset V(OPTO_EMITTER) = 2.5001\n.nodeset V(FB) = 2.5\n.nodeset V(5) ={Dcalc}
TEXT 2216 -48 Right 2 ;.tran 0 500m 0 startup
TEXT 2208 96 Right 2 !.model SW SW(Ron=10m, Roff=10Meg, Vt=2.5, Vh=-0.1)
TEXT 2208 136 Right 2 !.param Fs = 96k\n.param Ts = {1.0/{Fs}}\n.param D = 0.224\n.param Cout = 650u\n.param RL = 100\n.param VIN = 30\n.param VOUT =5.05
TEXT 2208 8 Right 2 !.param Lm = 9u\n.param Ns_div_Np = {1/2}\n.param Ls = ({Ns_div_Np}*{Ns_div_Np}*{Lm})
TEXT 2456 16 Left 2 !.param L = {Lm}\n.param Fsw = {Fs}\n.param n={Ns_div_Np}\n.param Lprim_ideal = 0.1\n.param Lsec_ideal = {{n}*{n}*{Lprim_ideal}}\n.param Rsns = 0.1
TEXT 2184 400 Right 0 !.MODEL 1N5811   D      (\n+         IS = 2.23137E-8\n+         RS = 0.0679124\n+          N = 1.5116445\n+         TT = 2.263E-8\n+        CJO = 1.48755E-10\n+         VJ = 0.5130456\n+          M = 0.4810824\n+         EG = 1.11\n+        XTI = 3\n+         KF = 0\n+         AF = 1\n+         FC = 0.998001\n+         BV = 1E5\n+        IBV = 1E-10\n+ )\n*$
TEXT 1152 16 Left 2 !.options\n+ Gmin = 1e-7\n+ Abstol = 1e-7\n+ Reltol = 0.001\n+ Chgtol = 1e-8\n+ Trtol = 2\n+ vntol = 0.001\n+ Sstol = 0.001\n+ MinDeltaGmin = 0.0001\n+ Method = Gear
TEXT 1152 456 Left 2 !.model Dideal D(Ron=1u Roff=10Meg Vfwd=1u Vrev=200)
TEXT 1160 416 Left 2 !.ac dec 1k 1 10Meg
TEXT 2016 336 Left 2 !.param Dcalc = ({VOUT}/{VIN})/(SQRT(({RL}*{Ts})/(2*{Lm})))
TEXT 704 640 Left 2 !.param VD_OPTO = 1.2\n.param CTR={2}\n.param RS_OPTO = 10.0\n.param fc_OPTO = 74k
TEXT 3656 368 Left 2 !.savebias dc_operating_point.txt time=400m
TEXT 3656 392 Left 2 !.loadbias dc_operating_point.txt
TEXT 1152 544 Left 2 !.model Din_Opto D(Ron=1u Roff=10Meg Vfwd=1.2 Vrev=200)
TEXT 1152 592 Left 2 !.param RESR_COUT=50m
TEXT 1152 648 Left 2 !.param LESL_CCER=5n\n.param LESL_CPOL=10n
TEXT 1160 728 Left 2 !.param Td_GATEDRV = {0.1*{Ts}}
LINE Normal 3248 1152 3248 1040
LINE Normal 3264 1152 3264 1040

The netlist it stands for:
* Demo_Flyback_AVGD_Model.asc
RL2 OUT 0 {RL}
C5 N024 0 {Cout/7}
E9 OUT2 0 OUT 0 1.0
R11 IN N004 75m
E10 1_AVG_CUSTOM 0 IN N003 1.0
E11 2_AVG_CUSTOM 0 0 N001 1.0
D3 N036 N011 1N4148
C6 IN N011 1000p
R12 IN N011 174
E12 Diode2 0 N001 N002 1.0
R14 N003 N036 10
RSNS N038 0 {RSNS}
D18 0 N037 CDZV16B
R48 IN N037 1k
Q6 IN N037 VCC_AVG 0 2N2222
C14 VCC_AVG 0 10µ
C15 VCC_AVG 0 1µ
R50 VCC_AVG 0 50k
S2 0 N046 N047 0 SW
R52 OUT N046 {15/0.1}
V6 N047 0 PULSE(0 5 67m 100n 100n 1m)
Lp1 N003 N005 {Lm}
Ls1 N006 0 {Ls}
V2 NC_01 0 PULSE(0 {VIN} 0 10m)
R1 INJ FB_SEC 10k
R3 FB_SEC 0 10k
C2 N048 IN_M_OPTO 0.1µ
R6 FB_SEC N048 150k
R8 INJ IN_P_OPTO 1k
R9 N045 INJ 1
C3 FB_SEC IN_M_OPTO 0.01µ
VINJ N045 OUT 0 AC 1
X§X2 0 IN_M_OPTO FB_SEC tl431
V3 IN 0 {VIN}
R20 N012 N024 {RESR_COUT}
D1 N002 N007 1N4148
C4 N025 0 {Cout/7}
R21 N013 N025 {RESR_COUT}
C8 N026 0 {Cout/7}
R22 N014 N026 {RESR_COUT}
C10 N027 0 {Cout/7}
R23 N015 N027 {RESR_COUT}
C12 N028 0 {Cout/7}
R24 N016 N028 {RESR_COUT}
C13 N029 0 {Cout/7}
R26 N017 N029 {RESR_COUT}
C16 N030 0 {Cout/7}
R27 N018 N030 {RESR_COUT}
L1 N004 N005 1.5µ
C17 N008 0 {Cout/7}
R2 IN N008 {RESR_COUT}
C18 N009 0 {Cout/7}
R30 IN N009 {RESR_COUT}
C19 N010 0 {Cout/7}
R31 IN N010 {RESR_COUT}
R32 OUT N007 0.1
R33 OUT 0 {{VOUT}/10m}
L2 OUT N012 {LESL_CPOL}
L3 OUT N013 {LESL_CPOL}
L4 OUT N014 {LESL_CPOL}
L5 OUT N015 {LESL_CPOL}
L6 OUT N016 {LESL_CPOL}
L7 OUT N017 {LESL_CPOL}
L8 OUT N018 {LESL_CPOL}
C20 N031 0 10µ
R34 N019 N031 10m
L9 OUT N019 {LESL_CCER}
C21 N032 0 10µ
R35 N020 N032 10m
L10 OUT N020 {LESL_CCER}
C22 N033 0 10µ
R36 N021 N033 10m
L11 OUT N021 {LESL_CCER}
C23 N034 0 10µ
R37 N022 N034 10m
L12 OUT N022 {LESL_CCER}
C24 N035 0 10µ
R38 N023 N035 10m
L13 OUT N023 {LESL_CCER}
R39 N001 N006 20m
C9 N041 0 100p
R7 N041 N038 1k
C11 N039 0 1000p
R15 VREF_5V N039 3.6k
C26 N042 N044 0.1µ
R17 COMP N042 30k
C27 COMP N044 1f
Q3 0 N043 COMP 0 2N2907
C28 N043 0 1µ
R18 N043 0 30k
R25 VREF_5V N043 10k
X§X3 N044 N041 N039 VCC_AVG IN 0 COMP N040 0 VREF_5V uc3845_avg params: L={Lm} Fsw={Fs} RSENSE={RSNS} CS_RATIO=1.0 Td_GDRV={0.1*{Ts}}
X§X1 N040 N003 N038 N002 N001 ccm-dcm2 params: L={Lm} Fsw={Fs} n={Ns_div_Np}
X§X4 IN_P_OPTO VREF_5V OPTO_OUT IN_M_OPTO opto_two_pole params: CTR={CTR} VF_D={VD_OPTO} RS_D={RS_OPTO} fc_Hz={fc_OPTO}
R4 OPTO_OUT 0 1k
R5 N044 OPTO_OUT 4.99k

* block symbol definitions
.subckt tl431 A K REF
Q1 K REF N006 0 NPN_TL431
Q2 N003 N003 N001 0 PNP_TL431
Q3 N004 N004 REF 0 NPN_TL431
R1 N006 N009 3.28k
Q4 N004 N003 N002 0 PNP_TL431
R2 K N001 800
R3 K N002 800
Q5 N003 N006 N008 0 NPN_TL431
R4 N008 N011 4k
Q6 N011 N010 A 0 NPN_TL431
C1 N011 N010 10p
Q7 N012 N012 A 0 NPN_TL431 AREA = 3
Q8 N010 N012 N014 0 NPN_TL431 AREA = 5.0777
R5 N009 N012 2.4k
R6 N009 N010 7.2k
R7 N014 A 800
Q9 N004 N013 A 0 NPN_TL431 AREA = 1
R8 N012 N013 1k
R9 A 0 10G
D1 A N004 1N4148
C2 K N004 10p
Q10 K N004 N005 0 NPN_TL431
R10 N005 N007 150
R11 N007 A 10k
Q11 K N007 A 0 NPN_TL431
D2 A K 1N4148
* Circuit matches datasheet
* schematic, but VREF ~ 1.8V only.
* 1. Add resistor RTUNE and trim to provide 2.5V at VREF
* with unity-gain feedback
* 2. Changed 20pF caps to 10pF to provide wider BW
* 3. Add input buffer to model low (2-4uA) input current
.model NPN_TL431 NPN
.model PNP_TL431 PNP
* Use default LTSPICE NPN/PNP models, with model names
* changed to avoid naming conflict
* Beta = 200, no BJT capacitances
.ends tl431

.subckt uc3845_avg FB ISENSE RT_CT VCC VINDUCTOR+_w_SW_ON VINDUCTOR-_w_SW_ON COMP OUT RTN VREF
Q1 0 0 0 0 NPN_UC2845
Q2 0 0 0 0 PNP_UC2845
S1 N002 VCC VCC 0 SW_UC2845
D1 RTN VCC UDZV33B
D2 COMP N009 1N4148
I1 VBIAS COMP 500µ
D3 COMP VBIAS Dideal_UC2845
R5 VBIAS N012 5k
R6 N012 RTN 5k
D4 COMP N010 Dtyp_UC2845
D5 N010 N011 Dtyp_UC2845
R7 N011 ERR_AMP_OUT 100k
R8 ERR_AMP_OUT RTN 50k
R10 RT_CT 0 1G
E1 DUTY_OUT_PEAK_CM_CTL RTN ERR_AMP_OUT SCALED_IPEAK 10k
D6 N004 N015 Dideal_UC2845
V1 N015 RTN {Max_Duty}
D7 RTN N004 Dideal_UC2845
E2 N003 RTN DUTY_OUT_PEAK_CM_CTL RTN 1
R11 N003 N004 10k
E3 N005 RTN N004 RTN 2.0
R12 N006 N005 50
T1 N007 RTN N006 RTN Td={Td_GDRV} Z0=50
R13 N007 RTN 50
RConv1 RTN 0 10G
E5 VLP 0 VINDUCTOR+_w_SW_ON RTN 1
RDum2 VINDUCTOR+_w_SW_ON RTN 1G
E6 VLM 0 VINDUCTOR-_w_SW_ON RTN 1
RDum3 VINDUCTOR-_w_SW_ON RTN 1G
E7 I_Avg 0 ISENSE RTN {1.0/{RSENSE}}
RDum4 ISENSE RTN 1G
B1 I_Ripple 0 V={ ( (1/2)*V(DUTY_OUT_PEAK_CM_CTL)* (1/{Fsw}) ) * ( abs(V(VLP,VLM))/({L}) ) }
B2 I_Peak_DCM 0 V= { ( 2*V(I_Ripple) ) }
B3 I_Peak_CCM 0 V= { (V(I_Ripple) )+ V(I_Avg) }
B4 I_Peak RTN V= MAX(V(I_Peak_DCM), V(I_Peak_CCM))
E8 SCALED_IPEAK RTN I_Peak RTN {{CS_RATIO}*{RSENSE}}
BMode1 Mode 0 V= IF(V(I_Peak_CCM) > V(I_Peak_DCM), 1, 0)
E9 OUT RTN N007 RTN 1.0
R1 N002 N008 10k
E4 N013 RTN N008 RTN 1.0
R2 N008 RTN 10G
R3 VCC RTN 1Meg
E10 N001 RTN N008 RTN 1.0
D8 N008 N016 Dideal_UC2845
VREF_5V N016 RTN 5
VSNS1 N013 N014 0
VSNS2 N001 VBIAS 0
B5 VCC RTN I={I(VSNS1)+I(VSNS2)}
R4 N014 VREF 5
X§U1 N012 FB VBIAS RTN N009 EA  ; pins In+ In- V+ V- OUT
.model NPN_UC2845 NPN
.model PNP_UC2845 PNP
.model SW_UC2845 SW(Ron=10m, Roff=100Meg, Vt={UVLO_THRES}, Vh={-{UVLO_HYST}})
.param UVLO_ON_THRESH = 8.4
.param UVLO_OFF_THRESH = 7.6
.param UVLO_THRES = 0.5*({UVLO_ON_THRESH}+{UVLO_OFF_THRESH})
.param UVLO_HYST = {0.5*(abs(UVLO_ON_THRESH-UVLO_OFF_THRESH))}
* UVLO
* Enable
* Switch
.model Dideal_UC2845 D(Ron=1u Roff=10Meg Vfwd=10m Vrev=500)
.model Dtyp_UC2845 D(Ron=10m Roff=10Meg Vfwd=0.7 Vrev=200)
* DCM occurs when: I_Avg < I_pk-pk/2  [1]
* I_Ripple = I_pk-pk/2                                [2]
* Add [2] to both sides of [1]
* I_Avg + I_Ripple < I_pk-pk
* in other words,
* DCM when I_pk-pk > I_Avg + I_Ripple
* CCM when I_Avg + I_Ripple > I_pk-pk
* Therefore, using whichever is  greater
* yields the correct peak current value
* for Duty Cycle Calculations
* Determine CCM or DCM
* Inputs and Ripple Calculation
* Sense Scaling
* 0 = DCM
* 1 = CCM
.param L = 10u
.param Fsw = 100k
.param Tsw = {1.0/{Fsw}}
.param Td_GDRV = {0.1*{Tsw}}
.param Max_Duty = 0.44
.param RSENSE = 100m
.param CS_RATIO = 1.0
* Averaged Peak Current Mode Controller
* Peak Current Mode Calculations
* Duty-Cycle Limiter
* Duty Cycle
* Output:
* Limited between 0 and Dmax
*Use with opamp2 symbol
.subckt EA IN+ IN- V+ V- OUT
Q1 N004 IN- N010 0 NPN_EA
Q2 N006 IN+ N010 0 NPN_EA
Q3 N010 N007 N014 0 NPN_EA
Q4 V+ N002 N003 0 NPN_EA
Q5 N002 N003 N007 0 NPN_EA
R1 N003 N007 5k
R2 V+ N002 5k
X§U2 N012 V- LT1004-1.2 ;§pnba VOUT)GND
Q6 N007 N007 N012 0 NPN_EA
Q7 N001 N007 N013 0 NPN_EA
R3 N013 V- {Vref_EA/Ibias_EA}
R5 N014 V- {Vref_EA/Ibias_EA}
Q10 N001 N001 V+ 0 PNP_EA
Q11 N011 N011 V- 0 NPN_EA
Q12 N008 N011 V- 0 NPN_EA
Q13 N009 N008 V- 0 NPN_EA
R6 N004 N011 5k
R7 N006 N008 5k
Q14 N004 N001 V+ 0 PNP_EA
Q15 N006 N001 V+ 0 PNP_EA
Q16 N005 N005 N009 0 NPN_EA
Q17 N005 N001 V+ 0 PNP_EA
Q18 V+ N005 OUT 0 NPN_EA
R8 OUT N009 200
R12 N009 V- 50k
C1 N111 N008 100p
RZ N009 N111 100
CP N009 N008 10p
R4 V- 0 10G
.model NPN NPN
.model PNP PNP
.lib standard.bjt
.model NPN_EA NPN(IS=1E-14 VAF=100 BF=200 IKF=0.3 XTB=1.5
+BR=3 CJC=3E-12 CJE=10E-12 TR=250E-12 TF=250E-12
+ITF=1 VTF=2 XTF=3 RB=10 RC=.3 RE=.2 Vceo=30 Icrating=800m mfg=NXP)
.model PNP_EA PNP(IS=1E-14 VAF=120 BF=250 IKF=0.3
+XTB=1.5 BR=3 CJC=3E-12 CJE=10E-12 TR=250E-12
+TF=250E-12 ITF=1 VTF=2 XTF=3 RB=10 RC=.3 RE=.2
+Vceo=40 Icrating=600m mfg=NXP)
.param Vref_EA=1.2
.param Ibias_EA=1m
.lib LTC3.lib
.backanno
.ends
.ends uc3845_avg

.subckt ccm-dcm2 5 1 2 3 4
B§Eu1 N001 0 V={MAX(v(5), v(5)*v(5)/(v(5)*v(5)+2*{L}*{n}*{Fsw}*i(Va)/v(3,4)))}
B§Et 1 2 V={(1-v(u))*v(3,4)/v(u)/{n}}
B§Gd 4 3 I={(1-v(u))*i(Et)/v(u)/{n}}
B§Ga 0 N003 I={MAX(i(Et),0)}
Va N003 N004 0
Rdummy N004 0 10
E1 N002 0 N001 0 1.0
R2 u N002 1
D1 u N005 Dideal
V1 N005 0 1
R1 5 0 10Meg
R4 2 0 1G
R5 3 0 1G
* n =  Sec side Turns Divided
* by Pri side Turns ratio
.param L=10u
.param n = 1
.param Fsw = 100k
* *IMPORTANT! If using in a non-isolated application, set n=1
.ends ccm-dcm2

.subckt opto_two_pole A C E K
DIN N006 K Din_Opto
R4 E 0 10G
C1 N002 0 220p
R16 N002 N001 10k
Q1 C N005 E 0 NPN_OPTO
B2 N001 0 V={I(SNS_OPTO_IN)}
V§SNS_OPTO_IN A N006 0
R19 K 0 10G
R1 A 0 10G
R2 C 0 10G
G1 0 N005 N004 0 {{CTR}/{BETA_OPTO}}
E1 N003 0 N002 0 1.0
C2 N004 0 220p
R3 N004 N003 10k
R5 N005 0 10Meg
.param CTR = 1.0
.param RS_D = 10.0
.param VF_D = 1.2
.param fc_Hz = 100k
.model Din_Opto D(Ron={RS_D} Roff=10Meg Vfwd={VF_D} Vrev=200 Is=2.52n Rs=.568 N=1.752 Cjo=4p M=.4 tt=20n Iave=200m Vpk=75)
.param BETA_OPTO=200
.model NPN_OPTO NPN(BF={BETA_OPTO}IS=1E-14 VAF=100 IKF=0.3 XTB=1.5 BR=3 CJC=8E-12 CJE=25E-12 TR=100E-9 TF=400E-12 ITF=1 VTF=2 XTF=3 RB=10 RC=.3 RE=.2 Vceo=30 Icrating=800m)
* 2-Pole Optocoupler
.param Cp = {2*PI*{fc_Hz}*10k}
* User-Entered Parameters
.ends opto_two_pole

.model D D
.lib standard.dio
.model NPN NPN
.model PNP PNP
.lib standard.bjt
* Load Step
K2 Lp1 Ls1 1
* .nodeset V(3) = 5
* .nodeset V(INJ2) = 5
* .nodeset V(FB_SEC) = 2.5
* .nodeset V(IN_P_OPTO) = 3.4
* .nodeset V(IN_M_OPTO) = 2.7
* .nodeset V(OPTO_EMITTER) = 2.5001
* .nodeset V(FB) = 2.5
* .nodeset V(5) ={Dcalc}
* .tran 0 500m 0 startup
.model SW SW(Ron=10m, Roff=10Meg, Vt=2.5, Vh=-0.1)
.param Fs = 96k
.param Ts = {1.0/{Fs}}
.param D = 0.224
.param Cout = 650u
.param RL = 100
.param VIN = 30
.param VOUT =5.05
.param Lm = 9u
.param Ns_div_Np = {1/2}
.param Ls = ({Ns_div_Np}*{Ns_div_Np}*{Lm})
.param L = {Lm}
.param Fsw = {Fs}
.param n={Ns_div_Np}
.param Lprim_ideal = 0.1
.param Lsec_ideal = {{n}*{n}*{Lprim_ideal}}
.param Rsns = 0.1
.MODEL 1N5811   D      (
+         IS = 2.23137E-8
+         RS = 0.0679124
+          N = 1.5116445
+         TT = 2.263E-8
+        CJO = 1.48755E-10
+         VJ = 0.5130456
+          M = 0.4810824
+         EG = 1.11
+        XTI = 3
+         KF = 0
+         AF = 1
+         FC = 0.998001
+         BV = 1E5
+        IBV = 1E-10
+ )
*$
.options
+ Gmin = 1e-7
+ Abstol = 1e-7
+ Reltol = 0.001
+ Chgtol = 1e-8
+ Trtol = 2
+ vntol = 0.001
+ Sstol = 0.001
+ MinDeltaGmin = 0.0001
+ Method = Gear
.model Dideal D(Ron=1u Roff=10Meg Vfwd=1u Vrev=200)
.ac dec 1k 1 10Meg
.param Dcalc = ({VOUT}/{VIN})/(SQRT(({RL}*{Ts})/(2*{Lm})))
.param VD_OPTO = 1.2
.param CTR={2}
.param RS_OPTO = 10.0
.param fc_OPTO = 74k
.savebias dc_operating_point.txt time=400m
.loadbias dc_operating_point.txt
.model Din_Opto D(Ron=1u Roff=10Meg Vfwd=1.2 Vrev=200)
.param RESR_COUT=50m
.param LESL_CCER=5n
.param LESL_CPOL=10n
.param Td_GATEDRV = {0.1*{Ts}}
.backanno
.end